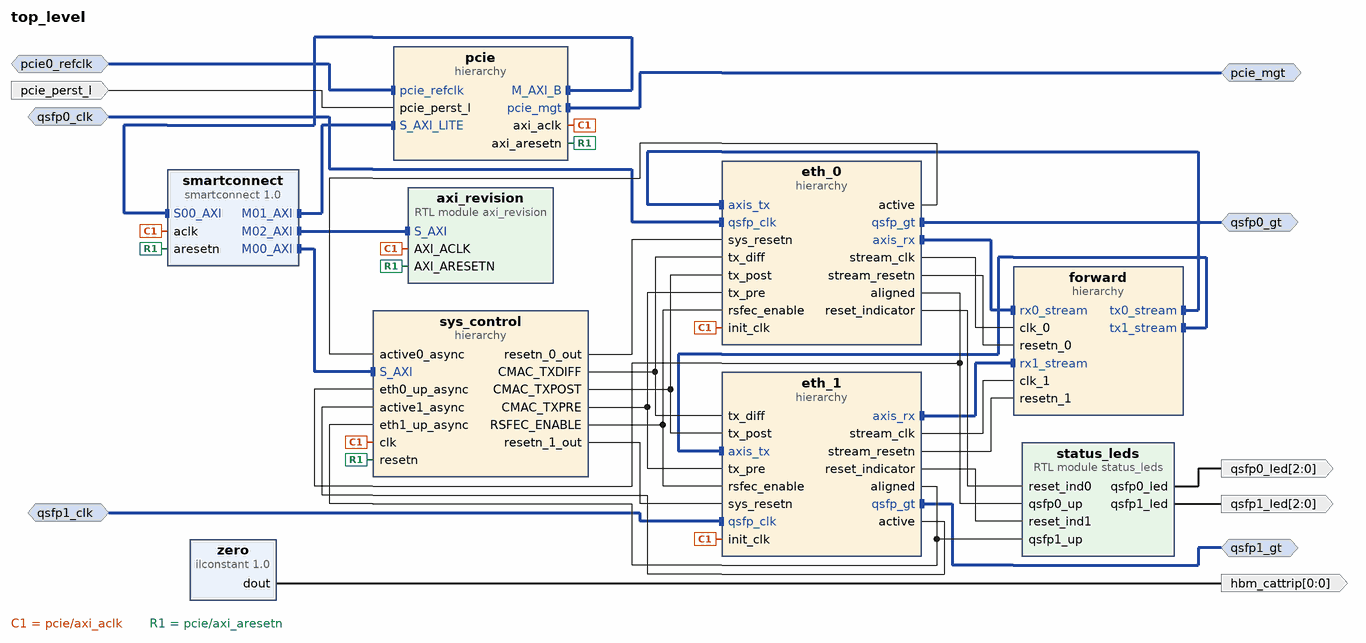
[diagram p0: block diagram of the top level]
# Vivado block design top_level, xcu55c-fsvh2892-2L-e, Vivado 2024.2
create_bd_design top_level

create_bd_intf_port -mode Slave -vlnv xilinx.com:interface:diff_clock_rtl:1.0 pcie0_refclk
create_bd_intf_port -mode Master -vlnv xilinx.com:interface:pcie_7x_mgt_rtl:1.0 pcie_mgt
create_bd_intf_port -mode Slave -vlnv xilinx.com:interface:diff_clock_rtl:1.0 qsfp0_clk
set_property -dict {CONFIG.FREQ_HZ 161132812} [get_bd_intf_ports qsfp0_clk]
create_bd_intf_port -mode Master -vlnv xilinx.com:interface:gt_rtl:1.0 qsfp0_gt
create_bd_intf_port -mode Master -vlnv xilinx.com:interface:gt_rtl:1.0 qsfp1_gt
create_bd_intf_port -mode Slave -vlnv xilinx.com:interface:diff_clock_rtl:1.0 qsfp1_clk
set_property -dict {CONFIG.FREQ_HZ 161132812} [get_bd_intf_ports qsfp1_clk]
create_bd_port -dir I pcie_perst_l
create_bd_port -dir O -from 2 -to 0 qsfp0_led
create_bd_port -dir O -from 2 -to 0 qsfp1_led
create_bd_port -dir O -from 0 -to 0 hbm_cattrip

create_bd_cell -type hier pcie
create_bd_cell -type hier eth_0
create_bd_cell -type hier eth_1
create_bd_cell -type hier sys_control
create_bd_cell -type ip -vlnv xilinx.com:ip:smartconnect:1.0 smartconnect
set_property -dict {CONFIG.NUM_CLKS 1 CONFIG.NUM_MI 3 CONFIG.NUM_SI 1} [get_bd_cells smartconnect]
create_bd_cell -type module -reference status_leds status_leds
create_bd_cell -type hier forward
create_bd_cell -type module -reference axi_revision axi_revision
create_bd_cell -type inline_hdl -vlnv xilinx.com:inline_hdl:ilconstant:1.0 zero

# ---- hierarchy /pcie ----
current_bd_instance /pcie
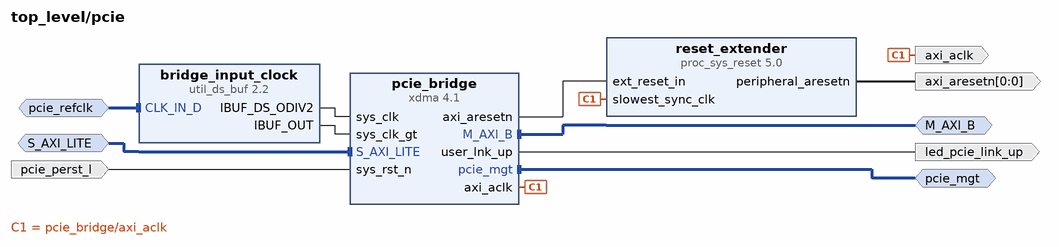
[diagram p1: block diagram inside /pcie]
create_bd_intf_pin -mode Master -vlnv xilinx.com:interface:aximm_rtl:1.0 M_AXI_B
create_bd_intf_pin -mode Slave -vlnv xilinx.com:interface:aximm_rtl:1.0 S_AXI_LITE
create_bd_intf_pin -mode Master -vlnv xilinx.com:interface:pcie_7x_mgt_rtl:1.0 pcie_mgt
create_bd_intf_pin -mode Slave -vlnv xilinx.com:interface:diff_clock_rtl:1.0 pcie_refclk
create_bd_pin -dir O led_pcie_link_up
create_bd_pin -dir O -type clk axi_aclk
create_bd_pin -dir O -from 0 -to 0 -type rst axi_aresetn
create_bd_pin -dir I pcie_perst_l

create_bd_cell -type ip -vlnv xilinx.com:ip:proc_sys_reset:5.0 reset_extender
create_bd_cell -type ip -vlnv xilinx.com:ip:util_ds_buf:2.2 bridge_input_clock
set_property -dict {CONFIG.C_BUF_TYPE IBUFDSGTE} [get_bd_cells bridge_input_clock]
create_bd_cell -type ip -vlnv xilinx.com:ip:xdma:4.1 pcie_bridge
set_property -dict [list \
  CONFIG.PF0_DEVICE_ID_mqdma 9038 \
  CONFIG.PF0_SRIOV_VF_DEVICE_ID A038 \
  CONFIG.PF2_DEVICE_ID_mqdma 9238 \
  CONFIG.PF3_DEVICE_ID_mqdma 9338 \
  CONFIG.axi_addr_width 64 \
  CONFIG.axi_data_width 256_bit \
  CONFIG.axisten_freq 250 \
  CONFIG.bridge_burst true \
  CONFIG.dma_reset_source_sel User_Reset \
  CONFIG.en_axi_slave_if false \
  CONFIG.enable_jtag_dbg false \
  CONFIG.functional_mode AXI_Bridge \
  CONFIG.mode_selection Advanced \
  CONFIG.pcie_blk_locn PCIE4C_X1Y1 \
  CONFIG.pf0_bar0_scale Megabytes \
  CONFIG.pf0_bar0_size 1 \
  CONFIG.pf0_device_id 903F \
  CONFIG.pl_link_cap_max_link_speed 8.0_GT/s \
  CONFIG.pl_link_cap_max_link_width X8 \
  CONFIG.plltype QPLL1 \
  CONFIG.runbit_fix false \
] [get_bd_cells pcie_bridge]

# ---- hierarchy /eth_0 ----
current_bd_instance /eth_0
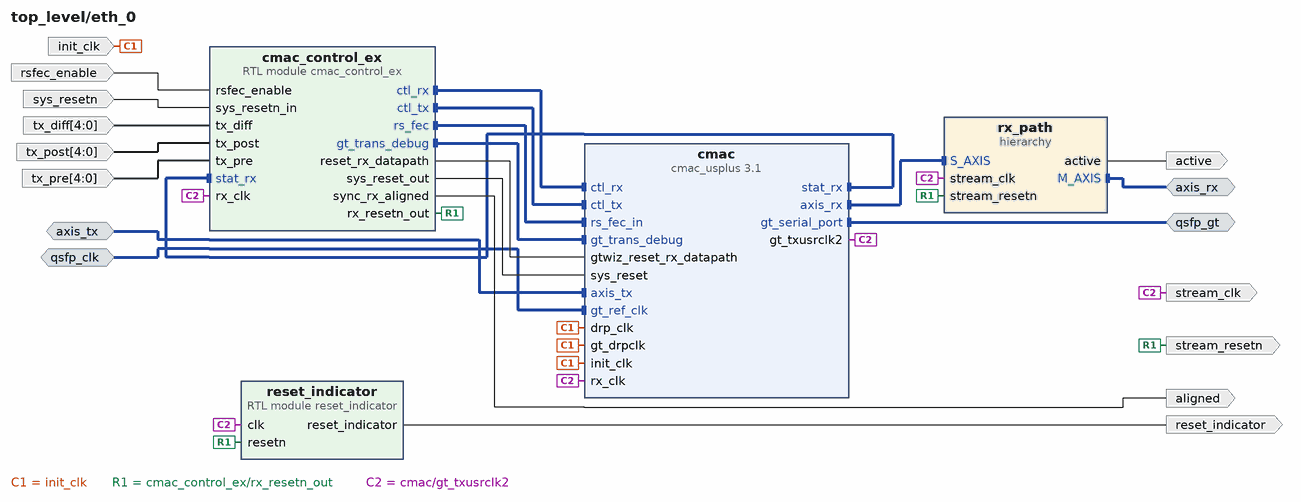
[diagram p2: block diagram inside /eth_0]
create_bd_intf_pin -mode Master -vlnv xilinx.com:interface:gt_rtl:1.0 qsfp_gt
create_bd_intf_pin -mode Slave -vlnv xilinx.com:interface:diff_clock_rtl:1.0 qsfp_clk
create_bd_intf_pin -mode Master -vlnv xilinx.com:interface:axis_rtl:1.0 axis_rx
create_bd_intf_pin -mode Slave -vlnv xilinx.com:interface:axis_rtl:1.0 axis_tx
create_bd_pin -dir I -type rst sys_resetn
create_bd_pin -dir O -type clk stream_clk
create_bd_pin -dir O -type rst stream_resetn
create_bd_pin -dir O aligned
create_bd_pin -dir I init_clk
create_bd_pin -dir I rsfec_enable
create_bd_pin -dir I -from 4 -to 0 tx_pre
create_bd_pin -dir I -from 4 -to 0 tx_post
create_bd_pin -dir I -from 4 -to 0 tx_diff
create_bd_pin -dir O active
create_bd_pin -dir O reset_indicator

create_bd_cell -type ip -vlnv xilinx.com:ip:cmac_usplus:3.1 cmac
set_property -dict [list \
  CONFIG.ADD_GT_CNRL_STS_PORTS 1 \
  CONFIG.CMAC_CAUI4_MODE 1 \
  CONFIG.CMAC_CORE_SELECT CMACE4_X0Y3 \
  CONFIG.GT_DRP_CLK 250 \
  CONFIG.GT_GROUP_SELECT {X0Y24~X0Y27} \
  CONFIG.GT_REF_CLK_FREQ 161.1328125 \
  CONFIG.INCLUDE_RS_FEC 1 \
  CONFIG.NUM_LANES 4x25 \
  CONFIG.RX_FLOW_CONTROL 0 \
  CONFIG.TX_FLOW_CONTROL 0 \
  CONFIG.USER_INTERFACE AXIS \
] [get_bd_cells cmac]
create_bd_cell -type module -reference cmac_control_ex cmac_control_ex
create_bd_cell -type hier rx_path
create_bd_cell -type module -reference reset_indicator reset_indicator

# ---- hierarchy /eth_0/rx_path ----
current_bd_instance /eth_0/rx_path
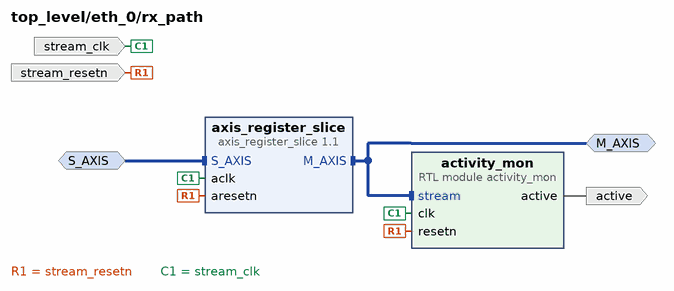
[diagram p3: block diagram inside /eth_0/rx_path]
create_bd_intf_pin -mode Slave -vlnv xilinx.com:interface:axis_rtl:1.0 S_AXIS
create_bd_intf_pin -mode Master -vlnv xilinx.com:interface:axis_rtl:1.0 M_AXIS
create_bd_pin -dir I -type clk stream_clk
create_bd_pin -dir I -type rst stream_resetn
create_bd_pin -dir O active

create_bd_cell -type module -reference activity_mon activity_mon
create_bd_cell -type ip -vlnv xilinx.com:ip:axis_register_slice:1.1 axis_register_slice

# ---- hierarchy /eth_1 ----
current_bd_instance /eth_1
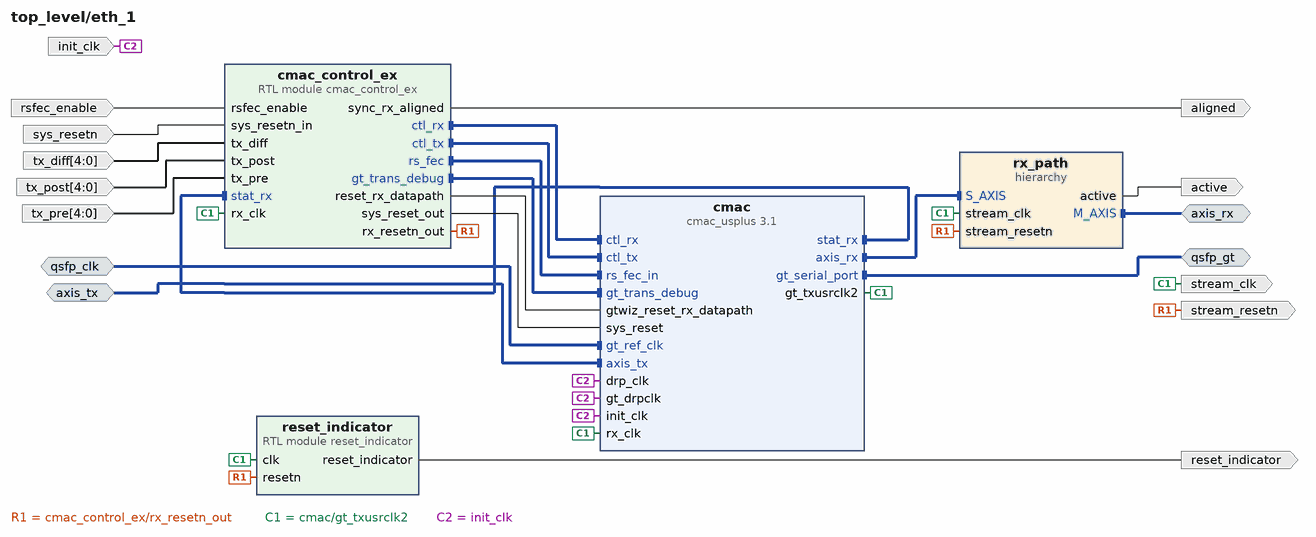
[diagram p4: block diagram inside /eth_1]
create_bd_intf_pin -mode Master -vlnv xilinx.com:interface:gt_rtl:1.0 qsfp_gt
create_bd_intf_pin -mode Slave -vlnv xilinx.com:interface:axis_rtl:1.0 axis_tx
create_bd_intf_pin -mode Master -vlnv xilinx.com:interface:axis_rtl:1.0 axis_rx
create_bd_intf_pin -mode Slave -vlnv xilinx.com:interface:diff_clock_rtl:1.0 qsfp_clk
create_bd_pin -dir I -type rst sys_resetn
create_bd_pin -dir O -type clk stream_clk
create_bd_pin -dir O -type rst stream_resetn
create_bd_pin -dir O aligned
create_bd_pin -dir I init_clk
create_bd_pin -dir I rsfec_enable
create_bd_pin -dir I -from 4 -to 0 tx_pre
create_bd_pin -dir I -from 4 -to 0 tx_post
create_bd_pin -dir I -from 4 -to 0 tx_diff
create_bd_pin -dir O active
create_bd_pin -dir O reset_indicator

create_bd_cell -type ip -vlnv xilinx.com:ip:cmac_usplus:3.1 cmac
set_property -dict [list \
  CONFIG.ADD_GT_CNRL_STS_PORTS 1 \
  CONFIG.CMAC_CAUI4_MODE 1 \
  CONFIG.CMAC_CORE_SELECT CMACE4_X0Y4 \
  CONFIG.GT_DRP_CLK 250 \
  CONFIG.GT_GROUP_SELECT {X0Y28~X0Y31} \
  CONFIG.GT_REF_CLK_FREQ 161.1328125 \
  CONFIG.INCLUDE_RS_FEC 1 \
  CONFIG.NUM_LANES 4x25 \
  CONFIG.RX_FLOW_CONTROL 0 \
  CONFIG.TX_FLOW_CONTROL 0 \
  CONFIG.USER_INTERFACE AXIS \
] [get_bd_cells cmac]
create_bd_cell -type module -reference cmac_control_ex cmac_control_ex
create_bd_cell -type hier rx_path
create_bd_cell -type module -reference reset_indicator reset_indicator

# ---- hierarchy /eth_1/rx_path ----
current_bd_instance /eth_1/rx_path
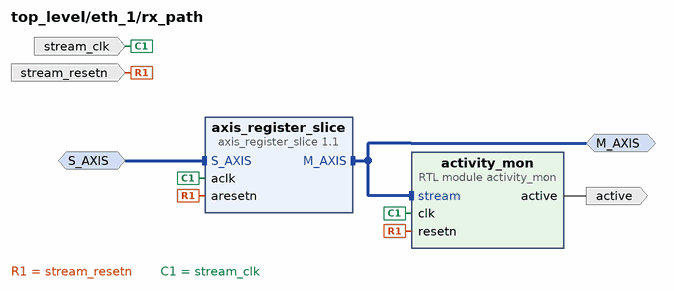
[diagram p5: block diagram inside /eth_1/rx_path]
create_bd_intf_pin -mode Slave -vlnv xilinx.com:interface:axis_rtl:1.0 S_AXIS
create_bd_intf_pin -mode Master -vlnv xilinx.com:interface:axis_rtl:1.0 M_AXIS
create_bd_pin -dir I -type clk stream_clk
create_bd_pin -dir I -type rst stream_resetn
create_bd_pin -dir O active

create_bd_cell -type module -reference activity_mon activity_mon
create_bd_cell -type ip -vlnv xilinx.com:ip:axis_register_slice:1.1 axis_register_slice

# ---- hierarchy /sys_control ----
current_bd_instance /sys_control
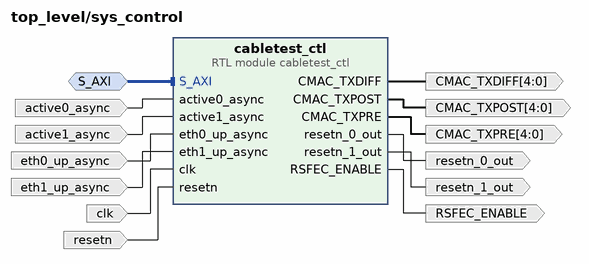
[diagram p6: block diagram inside /sys_control]
create_bd_intf_pin -mode Slave -vlnv xilinx.com:interface:aximm_rtl:1.0 S_AXI
create_bd_pin -dir I -type clk clk
create_bd_pin -dir I -type rst resetn
create_bd_pin -dir O RSFEC_ENABLE
create_bd_pin -dir O -from 4 -to 0 CMAC_TXPRE
create_bd_pin -dir O -from 4 -to 0 CMAC_TXDIFF
create_bd_pin -dir O -from 4 -to 0 CMAC_TXPOST
create_bd_pin -dir I active0_async
create_bd_pin -dir I active1_async
create_bd_pin -dir O resetn_0_out
create_bd_pin -dir O resetn_1_out
create_bd_pin -dir I eth0_up_async
create_bd_pin -dir I eth1_up_async

create_bd_cell -type module -reference cabletest_ctl cabletest_ctl

# ---- hierarchy /forward ----
current_bd_instance /forward
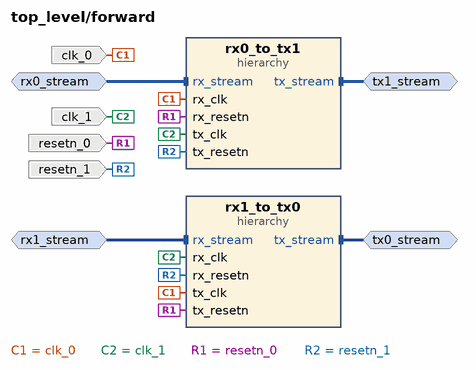
[diagram p7: block diagram inside /forward]
create_bd_intf_pin -mode Master -vlnv xilinx.com:interface:axis_rtl:1.0 tx1_stream
create_bd_intf_pin -mode Master -vlnv xilinx.com:interface:axis_rtl:1.0 tx0_stream
create_bd_intf_pin -mode Slave -vlnv xilinx.com:interface:axis_rtl:1.0 rx0_stream
create_bd_intf_pin -mode Slave -vlnv xilinx.com:interface:axis_rtl:1.0 rx1_stream
create_bd_pin -dir I clk_0
create_bd_pin -dir I clk_1
create_bd_pin -dir I resetn_0
create_bd_pin -dir I resetn_1

create_bd_cell -type hier rx0_to_tx1
create_bd_cell -type hier rx1_to_tx0

# ---- hierarchy /forward/rx0_to_tx1 ----
current_bd_instance /forward/rx0_to_tx1
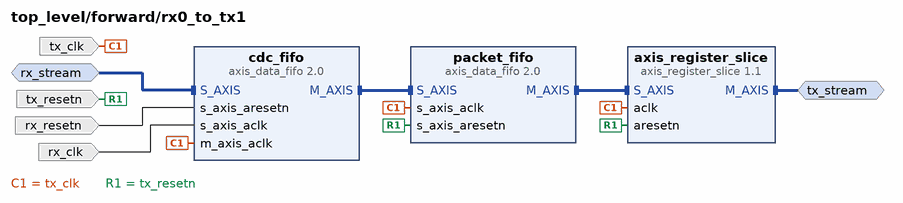
[diagram p8: block diagram inside /forward/rx0_to_tx1]
create_bd_intf_pin -mode Slave -vlnv xilinx.com:interface:axis_rtl:1.0 rx_stream
create_bd_intf_pin -mode Master -vlnv xilinx.com:interface:axis_rtl:1.0 tx_stream
create_bd_pin -dir I tx_clk
create_bd_pin -dir I rx_clk
create_bd_pin -dir I rx_resetn
create_bd_pin -dir I tx_resetn

create_bd_cell -type ip -vlnv xilinx.com:ip:axis_data_fifo:2.0 cdc_fifo
set_property -dict {CONFIG.FIFO_DEPTH 64 CONFIG.IS_ACLK_ASYNC 1} [get_bd_cells cdc_fifo]
create_bd_cell -type ip -vlnv xilinx.com:ip:axis_data_fifo:2.0 packet_fifo
set_property -dict {CONFIG.FIFO_DEPTH 16384 CONFIG.FIFO_MEMORY_TYPE ultra CONFIG.FIFO_MODE 2} [get_bd_cells packet_fifo]
create_bd_cell -type ip -vlnv xilinx.com:ip:axis_register_slice:1.1 axis_register_slice
set_property -dict {CONFIG.REG_CONFIG 8} [get_bd_cells axis_register_slice]

# ---- hierarchy /forward/rx1_to_tx0 ----
current_bd_instance /forward/rx1_to_tx0
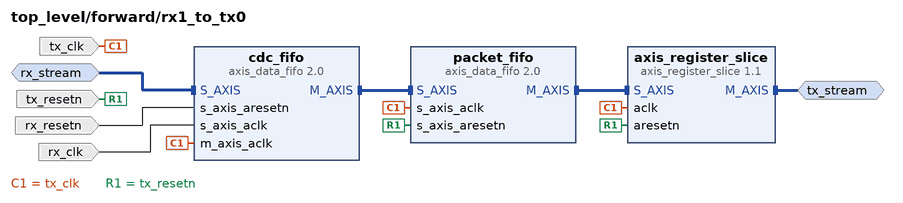
[diagram p9: block diagram inside /forward/rx1_to_tx0]
create_bd_intf_pin -mode Slave -vlnv xilinx.com:interface:axis_rtl:1.0 rx_stream
create_bd_intf_pin -mode Master -vlnv xilinx.com:interface:axis_rtl:1.0 tx_stream
create_bd_pin -dir I tx_clk
create_bd_pin -dir I rx_clk
create_bd_pin -dir I rx_resetn
create_bd_pin -dir I tx_resetn

create_bd_cell -type ip -vlnv xilinx.com:ip:axis_data_fifo:2.0 cdc_fifo
set_property -dict {CONFIG.FIFO_DEPTH 64 CONFIG.IS_ACLK_ASYNC 1} [get_bd_cells cdc_fifo]
create_bd_cell -type ip -vlnv xilinx.com:ip:axis_data_fifo:2.0 packet_fifo
set_property -dict {CONFIG.FIFO_DEPTH 16384 CONFIG.FIFO_MEMORY_TYPE ultra CONFIG.FIFO_MODE 2} [get_bd_cells packet_fifo]
create_bd_cell -type ip -vlnv xilinx.com:ip:axis_register_slice:1.1 axis_register_slice
set_property -dict {CONFIG.REG_CONFIG 8} [get_bd_cells axis_register_slice]

# ---- connections ----

current_bd_instance /pcie
connect_bd_intf_net [get_bd_intf_pins pcie_refclk] [get_bd_intf_pins bridge_input_clock/CLK_IN_D]
connect_bd_intf_net [get_bd_intf_pins S_AXI_LITE] [get_bd_intf_pins pcie_bridge/S_AXI_LITE]
connect_bd_intf_net [get_bd_intf_pins M_AXI_B] [get_bd_intf_pins pcie_bridge/M_AXI_B]
connect_bd_intf_net [get_bd_intf_pins pcie_mgt] [get_bd_intf_pins pcie_bridge/pcie_mgt]
connect_bd_net [get_bd_pins bridge_input_clock/IBUF_DS_ODIV2] [get_bd_pins pcie_bridge/sys_clk]
connect_bd_net [get_bd_pins bridge_input_clock/IBUF_OUT] [get_bd_pins pcie_bridge/sys_clk_gt]
connect_bd_net [get_bd_pins pcie_bridge/axi_aresetn] [get_bd_pins reset_extender/ext_reset_in]
connect_bd_net [get_bd_pins pcie_perst_l] [get_bd_pins pcie_bridge/sys_rst_n]
connect_bd_net -net proc_sys_reset_0_peripheral_aresetn [get_bd_pins reset_extender/peripheral_aresetn] [get_bd_pins axi_aresetn]
connect_bd_net -net xdma_0_axi_aclk [get_bd_pins pcie_bridge/axi_aclk] [get_bd_pins axi_aclk] [get_bd_pins reset_extender/slowest_sync_clk]
connect_bd_net -net xdma_0_user_lnk_up [get_bd_pins pcie_bridge/user_lnk_up] [get_bd_pins led_pcie_link_up]

current_bd_instance /eth_0
connect_bd_intf_net [get_bd_intf_pins axis_rx] [get_bd_intf_pins rx_path/M_AXIS]
connect_bd_intf_net [get_bd_intf_pins axis_tx] [get_bd_intf_pins cmac/axis_tx]
connect_bd_intf_net [get_bd_intf_pins cmac_control_ex/ctl_rx] [get_bd_intf_pins cmac/ctl_rx]
connect_bd_intf_net [get_bd_intf_pins cmac_control_ex/ctl_tx] [get_bd_intf_pins cmac/ctl_tx]
connect_bd_intf_net [get_bd_intf_pins cmac_control_ex/rs_fec] [get_bd_intf_pins cmac/rs_fec_in]
connect_bd_intf_net [get_bd_intf_pins cmac_control_ex/gt_trans_debug] [get_bd_intf_pins cmac/gt_trans_debug]
connect_bd_intf_net [get_bd_intf_pins cmac_control_ex/stat_rx] [get_bd_intf_pins cmac/stat_rx]
connect_bd_intf_net [get_bd_intf_pins qsfp_gt] [get_bd_intf_pins cmac/gt_serial_port]
connect_bd_intf_net [get_bd_intf_pins qsfp_clk] [get_bd_intf_pins cmac/gt_ref_clk]
connect_bd_intf_net [get_bd_intf_pins rx_path/S_AXIS] [get_bd_intf_pins cmac/axis_rx]
connect_bd_net -net activity_mon_0_active [get_bd_pins rx_path/active] [get_bd_pins active]
connect_bd_net -net clk_0_1 [get_bd_pins init_clk] [get_bd_pins cmac/gt_drpclk] [get_bd_pins cmac/init_clk] [get_bd_pins cmac/drp_clk]
connect_bd_net [get_bd_pins cmac_control_ex/reset_rx_datapath] [get_bd_pins cmac/gtwiz_reset_rx_datapath]
connect_bd_net [get_bd_pins cmac_control_ex/rx_resetn_out] \
  [get_bd_pins stream_resetn] [get_bd_pins rx_path/stream_resetn] [get_bd_pins reset_indicator/resetn]
connect_bd_net [get_bd_pins cmac_control_ex/sync_rx_aligned] [get_bd_pins aligned]
connect_bd_net [get_bd_pins cmac_control_ex/sys_reset_out] [get_bd_pins cmac/sys_reset]
connect_bd_net -net cmac_gt_rxusrclk2 [get_bd_pins cmac/gt_txusrclk2] \
  [get_bd_pins stream_clk] [get_bd_pins rx_path/stream_clk] [get_bd_pins cmac/rx_clk] [get_bd_pins cmac_control_ex/rx_clk] \
  [get_bd_pins reset_indicator/clk]
connect_bd_net [get_bd_pins reset_indicator/reset_indicator] [get_bd_pins reset_indicator]
connect_bd_net [get_bd_pins rsfec_enable] [get_bd_pins cmac_control_ex/rsfec_enable]
connect_bd_net [get_bd_pins sys_resetn] [get_bd_pins cmac_control_ex/sys_resetn_in]
connect_bd_net [get_bd_pins tx_diff] [get_bd_pins cmac_control_ex/tx_diff]
connect_bd_net [get_bd_pins tx_post] [get_bd_pins cmac_control_ex/tx_post]
connect_bd_net [get_bd_pins tx_pre] [get_bd_pins cmac_control_ex/tx_pre]

current_bd_instance /eth_0/rx_path
connect_bd_intf_net [get_bd_intf_pins M_AXIS] [get_bd_intf_pins axis_register_slice/M_AXIS]
connect_bd_intf_net [get_bd_intf_pins M_AXIS] [get_bd_intf_pins activity_mon/stream]
connect_bd_intf_net [get_bd_intf_pins S_AXIS] [get_bd_intf_pins axis_register_slice/S_AXIS]
connect_bd_net -net activity_mon_0_active [get_bd_pins activity_mon/active] [get_bd_pins active]
connect_bd_net -net cmac_control_ex_rx_resetn_out [get_bd_pins stream_resetn] \
  [get_bd_pins axis_register_slice/aresetn] [get_bd_pins activity_mon/resetn]
connect_bd_net -net cmac_gt_rxusrclk2 [get_bd_pins stream_clk] [get_bd_pins axis_register_slice/aclk] [get_bd_pins activity_mon/clk]

current_bd_instance /eth_1
connect_bd_intf_net [get_bd_intf_pins qsfp_clk] [get_bd_intf_pins cmac/gt_ref_clk]
connect_bd_intf_net [get_bd_intf_pins axis_tx] [get_bd_intf_pins cmac/axis_tx]
connect_bd_intf_net [get_bd_intf_pins cmac/axis_rx] [get_bd_intf_pins rx_path/S_AXIS]
connect_bd_intf_net [get_bd_intf_pins cmac_control_ex/ctl_rx] [get_bd_intf_pins cmac/ctl_rx]
connect_bd_intf_net [get_bd_intf_pins cmac_control_ex/ctl_tx] [get_bd_intf_pins cmac/ctl_tx]
connect_bd_intf_net [get_bd_intf_pins cmac_control_ex/rs_fec] [get_bd_intf_pins cmac/rs_fec_in]
connect_bd_intf_net [get_bd_intf_pins cmac_control_ex/gt_trans_debug] [get_bd_intf_pins cmac/gt_trans_debug]
connect_bd_intf_net [get_bd_intf_pins cmac_control_ex/stat_rx] [get_bd_intf_pins cmac/stat_rx]
connect_bd_intf_net [get_bd_intf_pins qsfp_gt] [get_bd_intf_pins cmac/gt_serial_port]
connect_bd_intf_net [get_bd_intf_pins axis_rx] [get_bd_intf_pins rx_path/M_AXIS]
connect_bd_net -net cmac_control_ex_0_reset_rx_datapath [get_bd_pins cmac_control_ex/reset_rx_datapath] [get_bd_pins cmac/gtwiz_reset_rx_datapath]
connect_bd_net -net cmac_control_ex_0_rx_resetn_out [get_bd_pins cmac_control_ex/rx_resetn_out] \
  [get_bd_pins stream_resetn] [get_bd_pins rx_path/stream_resetn] [get_bd_pins reset_indicator/resetn]
connect_bd_net -net cmac_control_ex_0_sync_rx_aligned [get_bd_pins cmac_control_ex/sync_rx_aligned] [get_bd_pins aligned]
connect_bd_net -net cmac_control_ex_0_sys_reset_out [get_bd_pins cmac_control_ex/sys_reset_out] [get_bd_pins cmac/sys_reset]
connect_bd_net -net cmac_gt_rxusrclk2 [get_bd_pins cmac/gt_txusrclk2] \
  [get_bd_pins stream_clk] [get_bd_pins rx_path/stream_clk] [get_bd_pins cmac/rx_clk] [get_bd_pins cmac_control_ex/rx_clk] \
  [get_bd_pins reset_indicator/clk]
connect_bd_net -net init_clk_divider_init_clk [get_bd_pins init_clk] \
  [get_bd_pins cmac/gt_drpclk] [get_bd_pins cmac/init_clk] [get_bd_pins cmac/drp_clk]
connect_bd_net -net reset_indicator_0_reset_indicator [get_bd_pins reset_indicator/reset_indicator] [get_bd_pins reset_indicator]
connect_bd_net [get_bd_pins rsfec_enable] [get_bd_pins cmac_control_ex/rsfec_enable]
connect_bd_net [get_bd_pins rx_path/active] [get_bd_pins active]
connect_bd_net [get_bd_pins sys_resetn] [get_bd_pins cmac_control_ex/sys_resetn_in]
connect_bd_net [get_bd_pins tx_diff] [get_bd_pins cmac_control_ex/tx_diff]
connect_bd_net [get_bd_pins tx_post] [get_bd_pins cmac_control_ex/tx_post]
connect_bd_net [get_bd_pins tx_pre] [get_bd_pins cmac_control_ex/tx_pre]

current_bd_instance /eth_1/rx_path
connect_bd_intf_net [get_bd_intf_pins M_AXIS] [get_bd_intf_pins axis_register_slice/M_AXIS]
connect_bd_intf_net [get_bd_intf_pins M_AXIS] [get_bd_intf_pins activity_mon/stream]
connect_bd_intf_net [get_bd_intf_pins S_AXIS] [get_bd_intf_pins axis_register_slice/S_AXIS]
connect_bd_net -net activity_mon_0_active [get_bd_pins activity_mon/active] [get_bd_pins active]
connect_bd_net -net cmac_control_ex_rx_resetn_out [get_bd_pins stream_resetn] \
  [get_bd_pins axis_register_slice/aresetn] [get_bd_pins activity_mon/resetn]
connect_bd_net -net cmac_gt_rxusrclk2 [get_bd_pins stream_clk] [get_bd_pins axis_register_slice/aclk] [get_bd_pins activity_mon/clk]

current_bd_instance /sys_control
connect_bd_intf_net [get_bd_intf_pins S_AXI] [get_bd_intf_pins cabletest_ctl/S_AXI]
connect_bd_net [get_bd_pins active0_async] [get_bd_pins cabletest_ctl/active0_async]
connect_bd_net [get_bd_pins active1_async] [get_bd_pins cabletest_ctl/active1_async]
connect_bd_net [get_bd_pins cabletest_ctl/CMAC_TXDIFF] [get_bd_pins CMAC_TXDIFF]
connect_bd_net [get_bd_pins cabletest_ctl/CMAC_TXPOST] [get_bd_pins CMAC_TXPOST]
connect_bd_net [get_bd_pins cabletest_ctl/CMAC_TXPRE] [get_bd_pins CMAC_TXPRE]
connect_bd_net [get_bd_pins cabletest_ctl/RSFEC_ENABLE] [get_bd_pins RSFEC_ENABLE]
connect_bd_net [get_bd_pins cabletest_ctl/resetn_0_out] [get_bd_pins resetn_0_out]
connect_bd_net [get_bd_pins cabletest_ctl/resetn_1_out] [get_bd_pins resetn_1_out]
connect_bd_net [get_bd_pins eth0_up_async] [get_bd_pins cabletest_ctl/eth0_up_async]
connect_bd_net [get_bd_pins eth1_up_async] [get_bd_pins cabletest_ctl/eth1_up_async]
connect_bd_net -net source_200Mhz_clk [get_bd_pins clk] [get_bd_pins cabletest_ctl/clk]
connect_bd_net -net source_200Mhz_resetn [get_bd_pins resetn] [get_bd_pins cabletest_ctl/resetn]

current_bd_instance /forward
connect_bd_intf_net [get_bd_intf_pins rx0_stream] [get_bd_intf_pins rx0_to_tx1/rx_stream]
connect_bd_intf_net [get_bd_intf_pins tx1_stream] [get_bd_intf_pins rx0_to_tx1/tx_stream]
connect_bd_intf_net [get_bd_intf_pins rx1_stream] [get_bd_intf_pins rx1_to_tx0/rx_stream]
connect_bd_intf_net [get_bd_intf_pins tx0_stream] [get_bd_intf_pins rx1_to_tx0/tx_stream]
connect_bd_net -net clk_0_1 [get_bd_pins clk_0] [get_bd_pins rx0_to_tx1/rx_clk] [get_bd_pins rx1_to_tx0/tx_clk]
connect_bd_net -net clk_1_1 [get_bd_pins clk_1] [get_bd_pins rx0_to_tx1/tx_clk] [get_bd_pins rx1_to_tx0/rx_clk]
connect_bd_net -net resetn_0_1 [get_bd_pins resetn_0] [get_bd_pins rx0_to_tx1/rx_resetn] [get_bd_pins rx1_to_tx0/tx_resetn]
connect_bd_net -net resetn_1_1 [get_bd_pins resetn_1] [get_bd_pins rx1_to_tx0/rx_resetn] [get_bd_pins rx0_to_tx1/tx_resetn]

current_bd_instance /forward/rx0_to_tx1
connect_bd_intf_net [get_bd_intf_pins cdc_fifo/M_AXIS] [get_bd_intf_pins packet_fifo/S_AXIS]
connect_bd_intf_net [get_bd_intf_pins tx_stream] [get_bd_intf_pins axis_register_slice/M_AXIS]
connect_bd_intf_net [get_bd_intf_pins axis_register_slice/S_AXIS] [get_bd_intf_pins packet_fifo/M_AXIS]
connect_bd_intf_net [get_bd_intf_pins rx_stream] [get_bd_intf_pins cdc_fifo/S_AXIS]
connect_bd_net [get_bd_pins tx_clk] [get_bd_pins cdc_fifo/m_axis_aclk] [get_bd_pins packet_fifo/s_axis_aclk] [get_bd_pins axis_register_slice/aclk]
connect_bd_net [get_bd_pins rx_resetn] [get_bd_pins cdc_fifo/s_axis_aresetn]
connect_bd_net -net s_axis_aclk_1 [get_bd_pins rx_clk] [get_bd_pins cdc_fifo/s_axis_aclk]
connect_bd_net [get_bd_pins tx_resetn] [get_bd_pins packet_fifo/s_axis_aresetn] [get_bd_pins axis_register_slice/aresetn]

current_bd_instance /forward/rx1_to_tx0
connect_bd_intf_net [get_bd_intf_pins cdc_fifo/M_AXIS] [get_bd_intf_pins packet_fifo/S_AXIS]
connect_bd_intf_net [get_bd_intf_pins tx_stream] [get_bd_intf_pins axis_register_slice/M_AXIS]
connect_bd_intf_net [get_bd_intf_pins axis_register_slice/S_AXIS] [get_bd_intf_pins packet_fifo/M_AXIS]
connect_bd_intf_net [get_bd_intf_pins rx_stream] [get_bd_intf_pins cdc_fifo/S_AXIS]
connect_bd_net [get_bd_pins tx_clk] [get_bd_pins axis_register_slice/aclk] [get_bd_pins cdc_fifo/m_axis_aclk] [get_bd_pins packet_fifo/s_axis_aclk]
connect_bd_net [get_bd_pins rx_resetn] [get_bd_pins cdc_fifo/s_axis_aresetn]
connect_bd_net -net s_axis_aclk_1 [get_bd_pins rx_clk] [get_bd_pins cdc_fifo/s_axis_aclk]
connect_bd_net [get_bd_pins tx_resetn] [get_bd_pins axis_register_slice/aresetn] [get_bd_pins packet_fifo/s_axis_aresetn]

current_bd_instance /
connect_bd_intf_net [get_bd_intf_ports qsfp0_gt] [get_bd_intf_pins eth_0/qsfp_gt]
connect_bd_intf_net [get_bd_intf_pins eth_0/axis_rx] [get_bd_intf_pins forward/rx0_stream]
connect_bd_intf_net [get_bd_intf_pins eth_1/axis_rx] [get_bd_intf_pins forward/rx1_stream]
connect_bd_intf_net [get_bd_intf_ports qsfp1_gt] [get_bd_intf_pins eth_1/qsfp_gt]
connect_bd_intf_net [get_bd_intf_pins forward/tx0_stream] [get_bd_intf_pins eth_0/axis_tx]
connect_bd_intf_net [get_bd_intf_pins forward/tx1_stream] [get_bd_intf_pins eth_1/axis_tx]
connect_bd_intf_net [get_bd_intf_ports qsfp0_clk] [get_bd_intf_pins eth_0/qsfp_clk]
connect_bd_intf_net [get_bd_intf_ports qsfp1_clk] [get_bd_intf_pins eth_1/qsfp_clk]
connect_bd_intf_net [get_bd_intf_ports pcie0_refclk] [get_bd_intf_pins pcie/pcie_refclk]
connect_bd_intf_net [get_bd_intf_pins pcie/S_AXI_LITE] [get_bd_intf_pins smartconnect/M01_AXI]
connect_bd_intf_net [get_bd_intf_pins sys_control/S_AXI] [get_bd_intf_pins smartconnect/M00_AXI]
connect_bd_intf_net [get_bd_intf_pins smartconnect/M02_AXI] [get_bd_intf_pins axi_revision/S_AXI]
connect_bd_intf_net [get_bd_intf_pins pcie/M_AXI_B] [get_bd_intf_pins smartconnect/S00_AXI]
connect_bd_intf_net [get_bd_intf_ports pcie_mgt] [get_bd_intf_pins pcie/pcie_mgt]
connect_bd_net -net cabletest_CMAC_TXDIFF [get_bd_pins sys_control/CMAC_TXDIFF] [get_bd_pins eth_1/tx_diff] [get_bd_pins eth_0/tx_diff]
connect_bd_net -net cabletest_CMAC_TXPOST [get_bd_pins sys_control/CMAC_TXPOST] [get_bd_pins eth_1/tx_post] [get_bd_pins eth_0/tx_post]
connect_bd_net -net cabletest_CMAC_TXPRE [get_bd_pins sys_control/CMAC_TXPRE] [get_bd_pins eth_0/tx_pre] [get_bd_pins eth_1/tx_pre]
connect_bd_net -net cabletest_RSFEC_ENABLE [get_bd_pins sys_control/RSFEC_ENABLE] [get_bd_pins eth_1/rsfec_enable] [get_bd_pins eth_0/rsfec_enable]
connect_bd_net [get_bd_pins eth_0/active] [get_bd_pins sys_control/active0_async]
connect_bd_net [get_bd_pins eth_0/reset_indicator] [get_bd_pins status_leds/reset_ind0]
connect_bd_net -net eth_0_stat_rx_aligned_0 [get_bd_pins eth_0/aligned] [get_bd_pins sys_control/eth0_up_async] [get_bd_pins status_leds/qsfp0_up]
connect_bd_net [get_bd_pins eth_0/stream_clk] [get_bd_pins forward/clk_0]
connect_bd_net [get_bd_pins eth_0/stream_resetn] [get_bd_pins forward/resetn_0]
connect_bd_net [get_bd_pins eth_1/active] [get_bd_pins sys_control/active1_async]
connect_bd_net [get_bd_pins eth_1/reset_indicator] [get_bd_pins status_leds/reset_ind1]
connect_bd_net -net eth_1_stat_rx_aligned_0 [get_bd_pins eth_1/aligned] [get_bd_pins sys_control/eth1_up_async] [get_bd_pins status_leds/qsfp1_up]
connect_bd_net [get_bd_pins eth_1/stream_clk] [get_bd_pins forward/clk_1]
connect_bd_net [get_bd_pins eth_1/stream_resetn] [get_bd_pins forward/resetn_1]
connect_bd_net [get_bd_ports pcie_perst_l] [get_bd_pins pcie/pcie_perst_l]
connect_bd_net -net source_200Mhz_clk [get_bd_pins pcie/axi_aclk] \
  [get_bd_pins sys_control/clk] [get_bd_pins smartconnect/aclk] [get_bd_pins axi_revision/AXI_ACLK] \
  [get_bd_pins eth_1/init_clk] [get_bd_pins eth_0/init_clk]
connect_bd_net -net source_200Mhz_resetn [get_bd_pins pcie/axi_aresetn] \
  [get_bd_pins sys_control/resetn] [get_bd_pins smartconnect/aresetn] [get_bd_pins axi_revision/AXI_ARESETN]
connect_bd_net [get_bd_pins status_leds/qsfp0_led] [get_bd_ports qsfp0_led]
connect_bd_net [get_bd_pins status_leds/qsfp1_led] [get_bd_ports qsfp1_led]
connect_bd_net [get_bd_pins sys_control/resetn_0_out] [get_bd_pins eth_0/sys_resetn]
connect_bd_net [get_bd_pins sys_control/resetn_1_out] [get_bd_pins eth_1/sys_resetn]
connect_bd_net [get_bd_pins zero/dout] [get_bd_ports hbm_cattrip]

# ---- address map ----
assign_bd_address -offset 0x0000000000000000 -range 128 -target_address_space [get_bd_addr_spaces pcie/pcie_bridge/M_AXI_B] [get_bd_addr_segs axi_revision/S_AXI/reg0]
assign_bd_address -offset 0x0000000000001000 -range 128 -target_address_space [get_bd_addr_spaces pcie/pcie_bridge/M_AXI_B] [get_bd_addr_segs sys_control/cabletest_ctl/S_AXI/reg0]
assign_bd_address -offset 0x0000000000010000 -range 64K -target_address_space [get_bd_addr_spaces pcie/pcie_bridge/M_AXI_B] [get_bd_addr_segs pcie/pcie_bridge/S_AXI_LITE/CTL0]

validate_bd_design
save_bd_design
